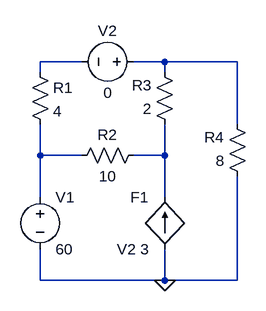
[diagram p0: schematic Draft17.asc]
Draft17.asc, the LTspice schematic file:
Version 4
SHEET 1 880 680
WIRE 128 0 64 0
WIRE 256 0 208 0
WIRE 368 0 256 0
WIRE 64 16 64 0
WIRE 256 16 256 0
WIRE 368 96 368 0
WIRE 64 144 64 96
WIRE 128 144 64 144
WIRE 256 144 256 96
WIRE 256 144 208 144
WIRE 64 208 64 144
WIRE 256 208 256 144
WIRE 64 336 64 288
WIRE 256 336 256 288
WIRE 256 336 64 336
WIRE 368 336 368 176
WIRE 368 336 256 336
FLAG 256 336 0
SYMBOL res 48 0 R0
SYMATTR InstName R1
SYMATTR Value 4
SYMBOL res 224 128 R90
WINDOW 0 0 56 VBottom 2
WINDOW 3 32 56 VTop 2
SYMATTR InstName R2
SYMATTR Value 10
SYMBOL res 272 112 R180
WINDOW 0 36 76 Left 2
WINDOW 3 36 40 Left 2
SYMATTR InstName R3
SYMATTR Value 2
SYMBOL res 384 192 R180
WINDOW 0 36 76 Left 2
WINDOW 3 36 40 Left 2
SYMATTR InstName R4
SYMATTR Value 8
SYMBOL voltage 64 192 R0
SYMATTR InstName V1
SYMATTR Value 60
SYMBOL f 256 288 R180
WINDOW 0 24 80 Left 2
WINDOW 3 24 0 Left 2
SYMATTR InstName F1
SYMATTR Value V2 3
SYMBOL voltage 224 0 R90
WINDOW 0 -32 56 VBottom 2
WINDOW 3 32 56 VTop 2
SYMATTR InstName V2
SYMATTR Value 0

The netlist it stands for:
* Draft17.asc
R1 N001 N003 4
R2 N004 N003 10
R3 N004 N002 2
R4 0 N002 8
V1 N003 0 60
F1 0 N004 V2 3
V2 N002 N001 0
.backanno
.end